# Altium schematic sheet Copy of PWR_PCB.SchDoc
size 863 x 558 mm
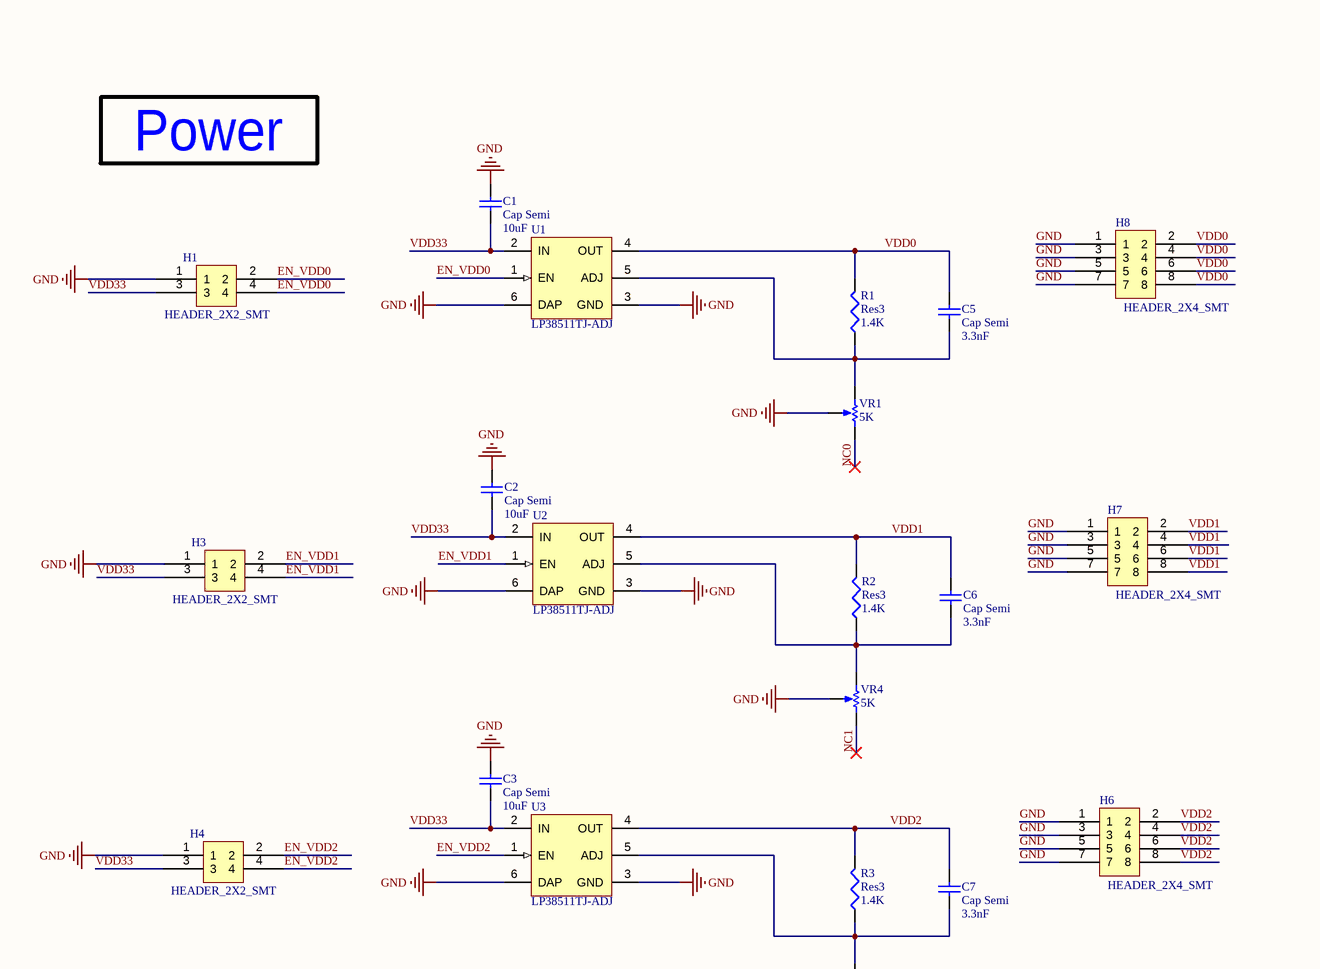
[diagram p0: Copy of PWR_PCB.SchDoc, top left]
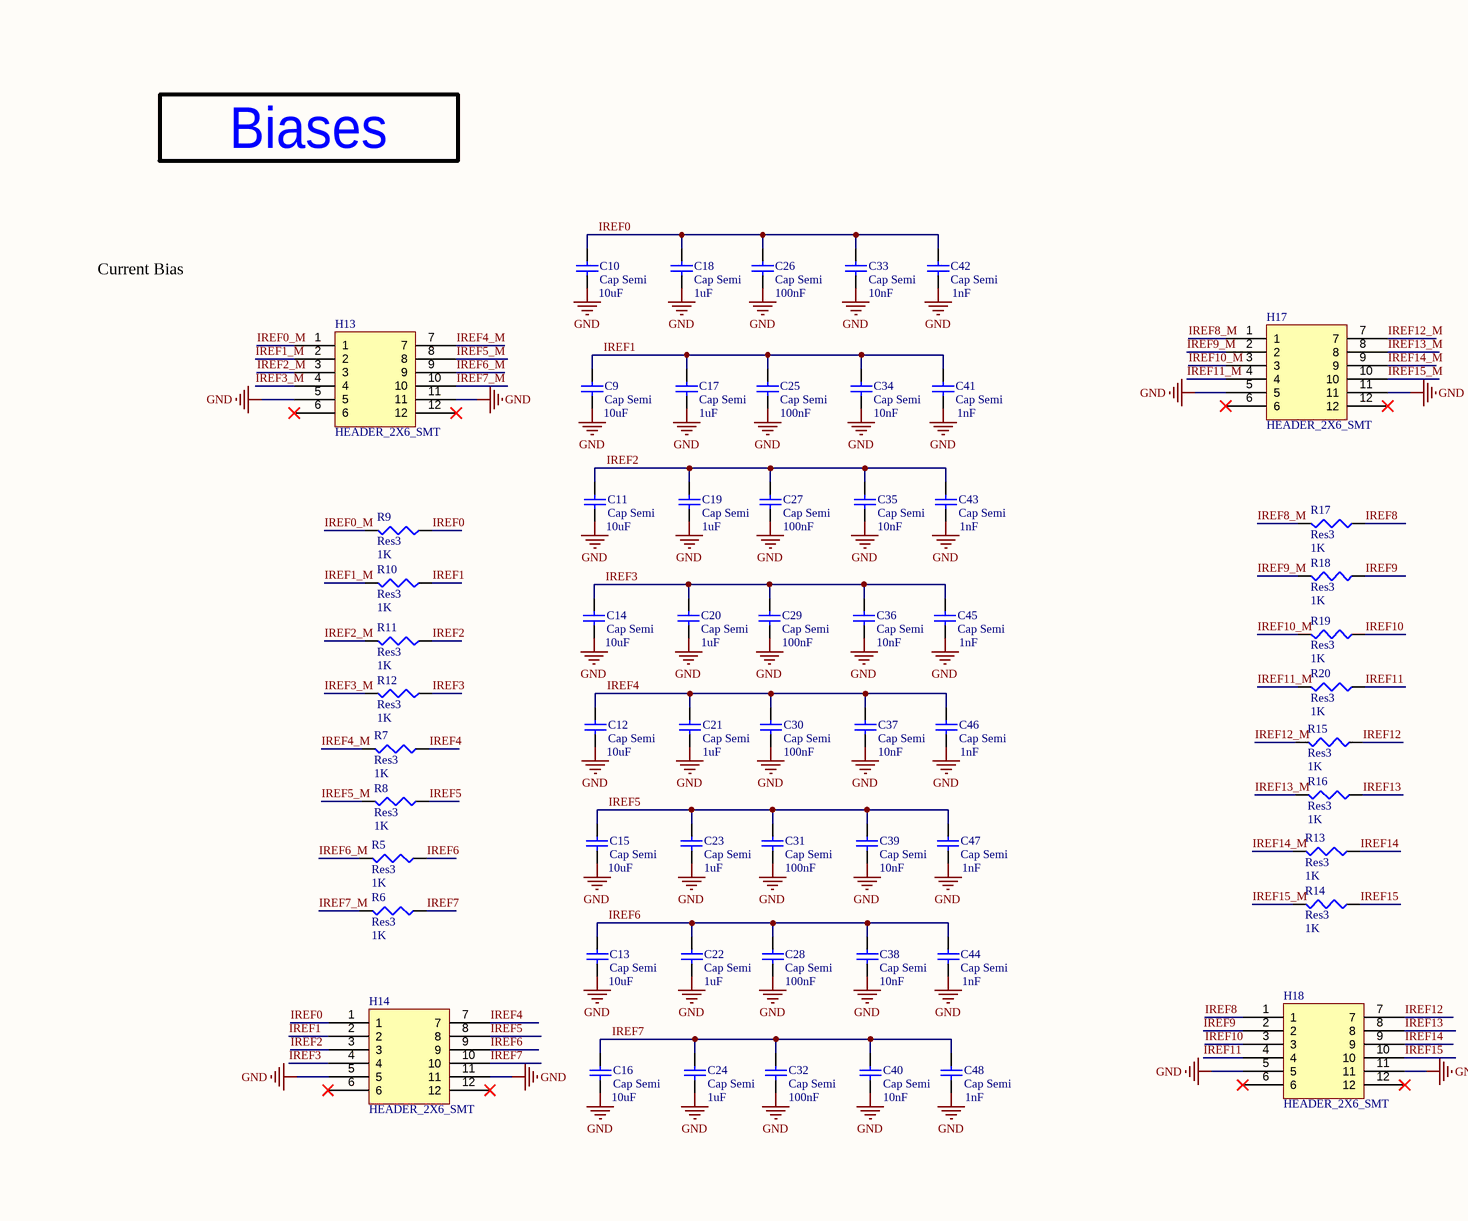
[diagram p1: Copy of PWR_PCB.SchDoc, top middle]
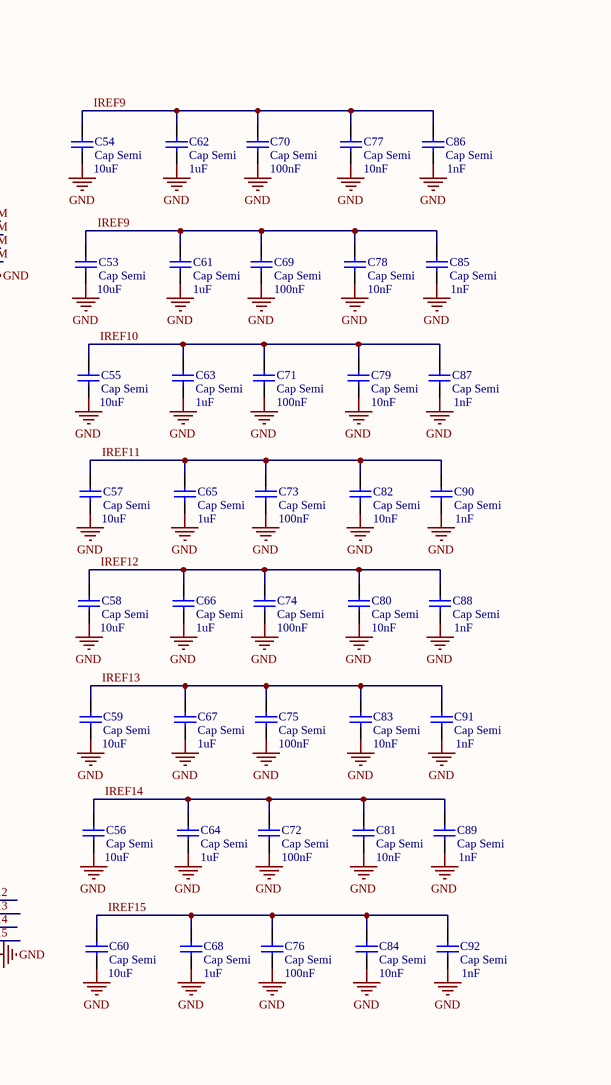
[diagram p2: Copy of PWR_PCB.SchDoc, top right]
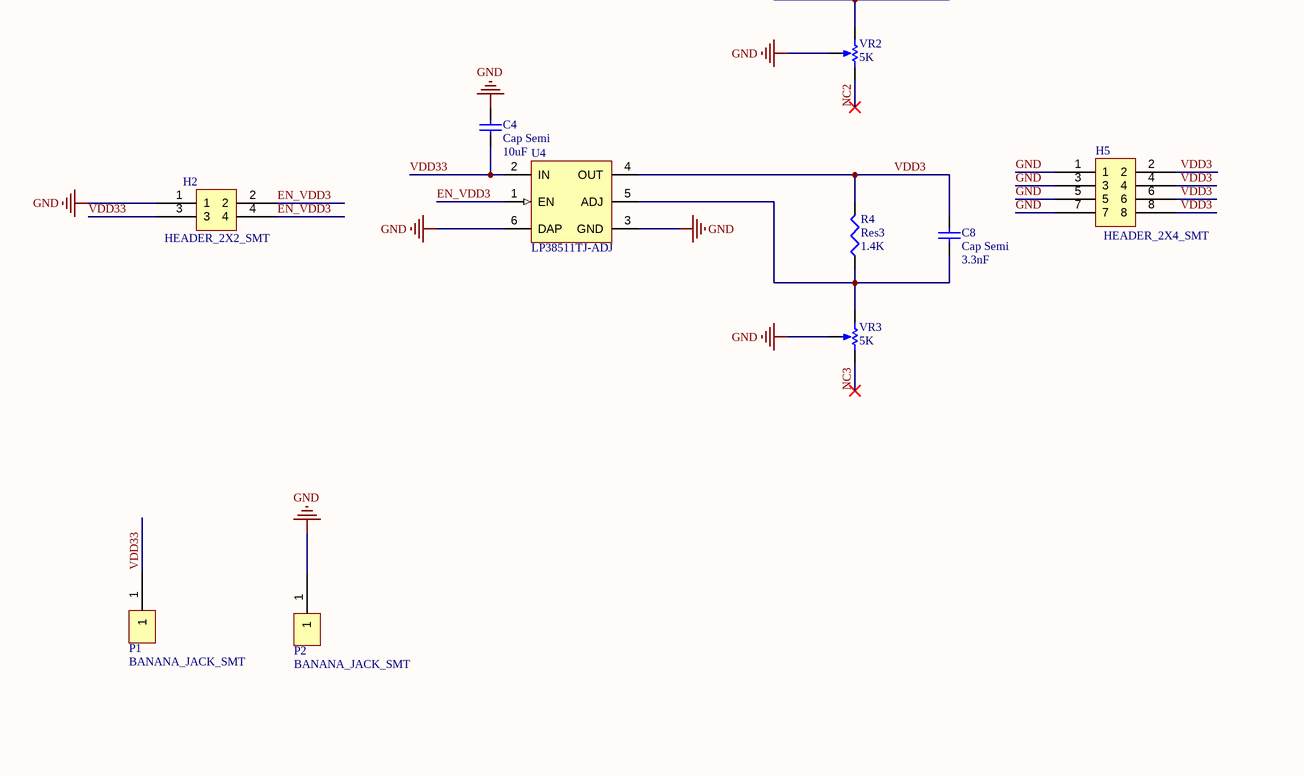
[diagram p3: Copy of PWR_PCB.SchDoc, bottom left]
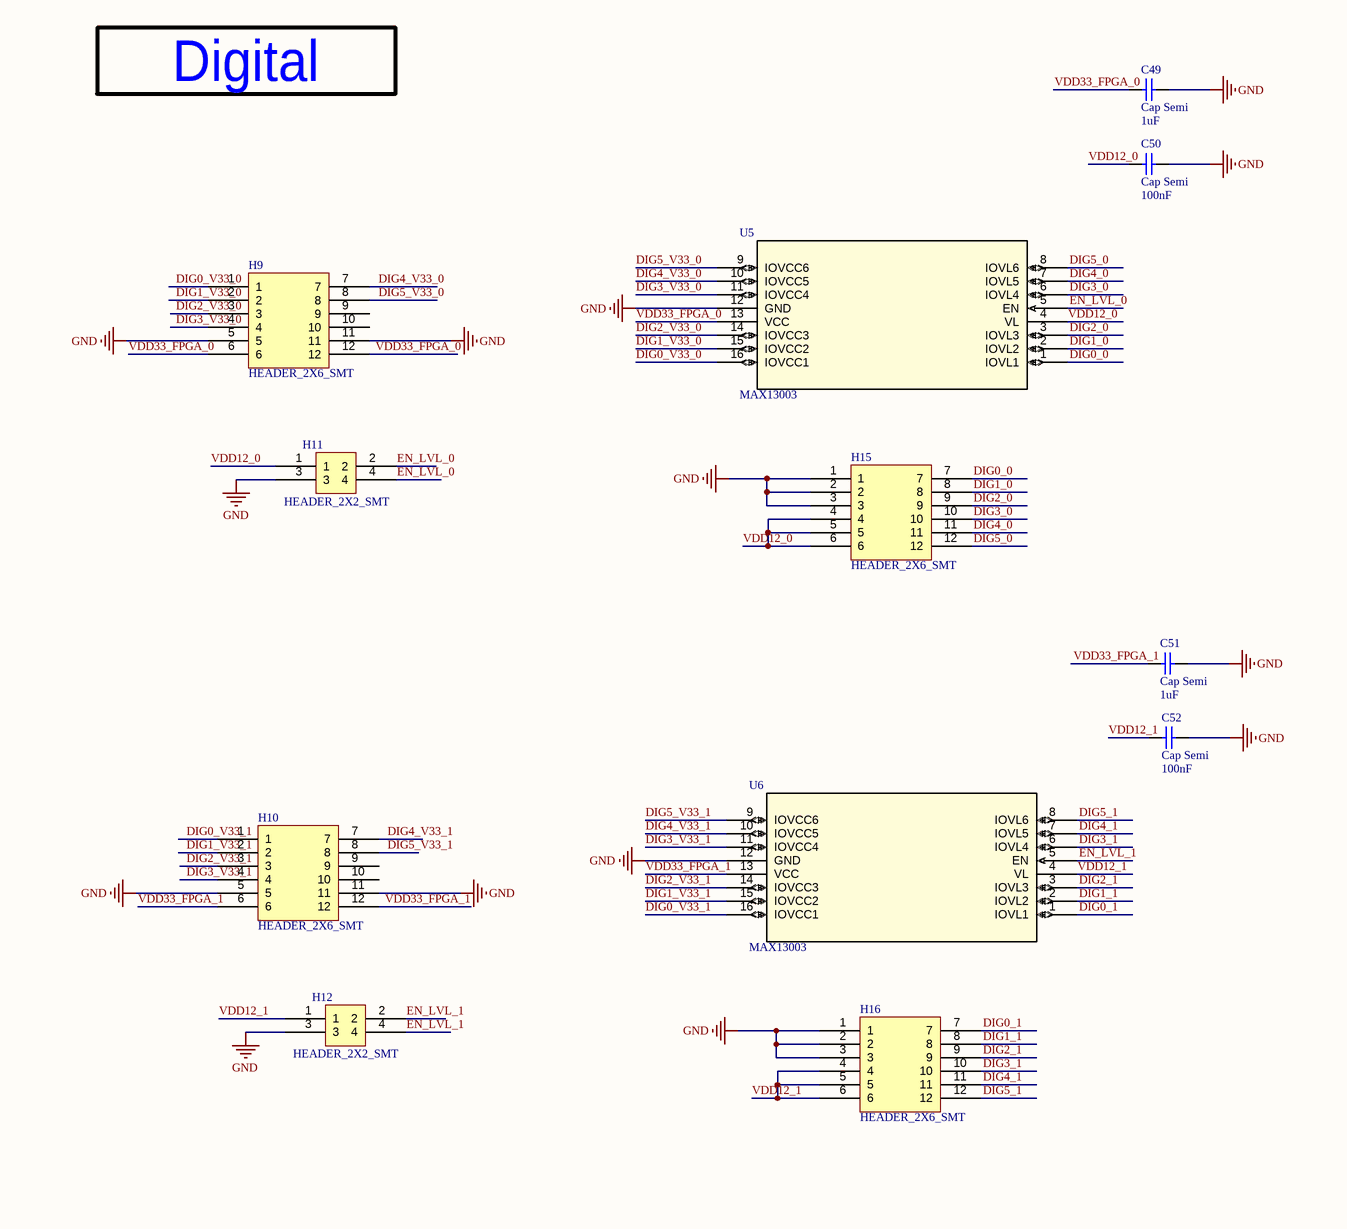
[diagram p4: Copy of PWR_PCB.SchDoc, bottom middle]
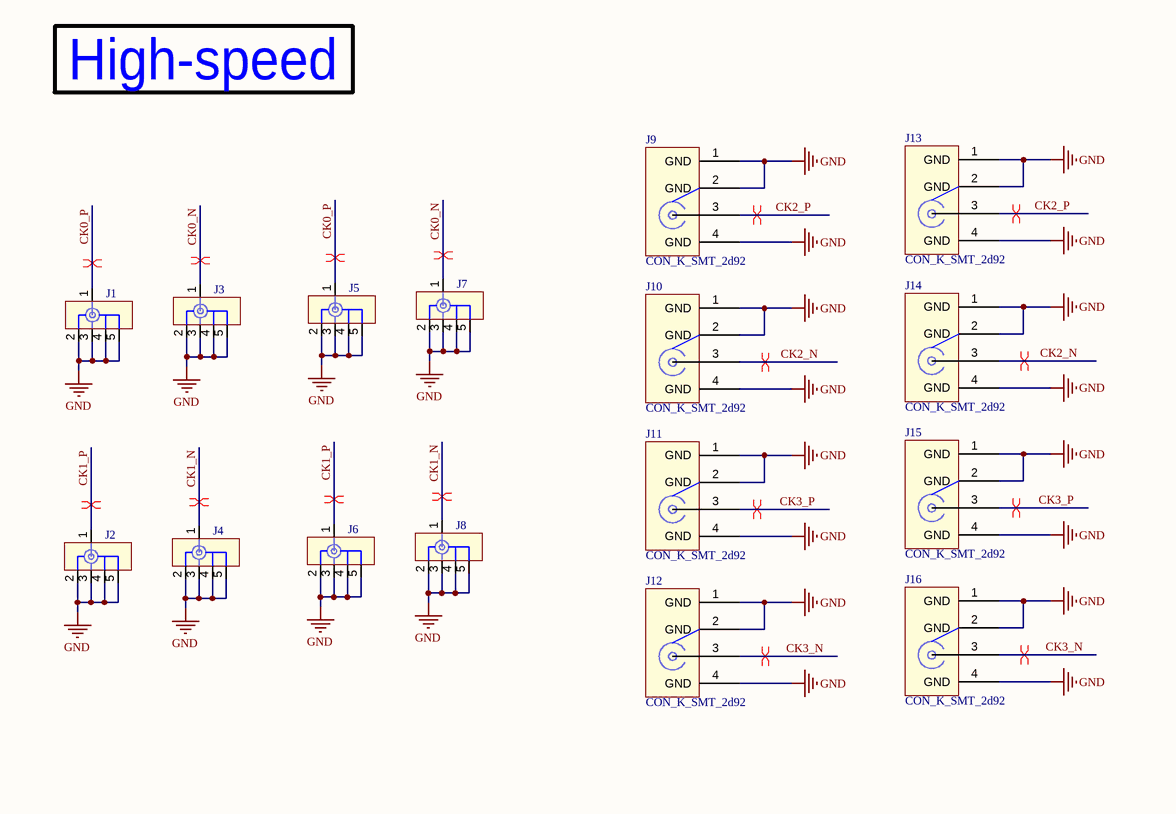
[diagram p5: Copy of PWR_PCB.SchDoc, bottom right]

## Parts
C1  Cap Semi  value 10uF  [1608[0603]]
C2  Cap Semi  value 10uF  [1608[0603]]
C3  Cap Semi  value 10uF  [1608[0603]]
C4  Cap Semi  value 10uF  [1608[0603]]
C5  Cap Semi  value 3.3nF  [1608[0603]]
C6  Cap Semi  value 3.3nF  [1608[0603]]
C7  Cap Semi  value 3.3nF  [1608[0603]]
C8  Cap Semi  value 3.3nF  [1608[0603]]
C9  Cap Semi  value 10uF  [1608[0603]]
C10  Cap Semi  value 10uF  [1608[0603]]
C11  Cap Semi  value 10uF  [1608[0603]]
C12  Cap Semi  value 10uF  [1608[0603]]
C13  Cap Semi  value 10uF  [1608[0603]]
C14  Cap Semi  value 10uF  [1608[0603]]
C15  Cap Semi  value 10uF  [1608[0603]]
C16  Cap Semi  value 10uF  [1608[0603]]
C17  Cap Semi  value 1uF  [1608[0603]]
C18  Cap Semi  value 1uF  [1608[0603]]
C19  Cap Semi  value 1uF  [1608[0603]]
C20  Cap Semi  value 1uF  [1608[0603]]
C21  Cap Semi  value 1uF  [1608[0603]]
C22  Cap Semi  value 1uF  [1608[0603]]
C23  Cap Semi  value 1uF  [1608[0603]]
C24  Cap Semi  value 1uF  [1608[0603]]
C25  Cap Semi  value 100nF  [1608[0603]]
C26  Cap Semi  value 100nF  [1608[0603]]
C27  Cap Semi  value 100nF  [1608[0603]]
C28  Cap Semi  value 100nF  [1608[0603]]
C29  Cap Semi  value 100nF  [1608[0603]]
C30  Cap Semi  value 100nF  [1608[0603]]
C31  Cap Semi  value 100nF  [1608[0603]]
C32  Cap Semi  value 100nF  [1608[0603]]
C33  Cap Semi  value 10nF  [1608[0603]]
C34  Cap Semi  value 10nF  [1608[0603]]
C35  Cap Semi  value 10nF  [1608[0603]]
C36  Cap Semi  value 10nF  [1608[0603]]
C37  Cap Semi  value 10nF  [1608[0603]]
C38  Cap Semi  value 10nF  [1608[0603]]
C39  Cap Semi  value 10nF  [1608[0603]]
C40  Cap Semi  value 10nF  [1608[0603]]
C41  Cap Semi  value 1nF  [1608[0603]]
C42  Cap Semi  value 1nF  [1608[0603]]
C43  Cap Semi  value 1nF  [1608[0603]]
C44  Cap Semi  value 1nF  [1608[0603]]
C45  Cap Semi  value 1nF  [1608[0603]]
C46  Cap Semi  value 1nF  [1608[0603]]
C47  Cap Semi  value 1nF  [1608[0603]]
C48  Cap Semi  value 1nF  [1608[0603]]
C49  Cap Semi  value 1uF  [1608[0603]]
C50  Cap Semi  value 100nF  [1608[0603]]
C51  Cap Semi  value 1uF  [1608[0603]]
C52  Cap Semi  value 100nF  [1608[0603]]
C53  Cap Semi  value 10uF  [1608[0603]]
C54  Cap Semi  value 10uF  [1608[0603]]
C55  Cap Semi  value 10uF  [1608[0603]]
C56  Cap Semi  value 10uF  [1608[0603]]
C57  Cap Semi  value 10uF  [1608[0603]]
C58  Cap Semi  value 10uF  [1608[0603]]
C59  Cap Semi  value 10uF  [1608[0603]]
C60  Cap Semi  value 10uF  [1608[0603]]
C61  Cap Semi  value 1uF  [1608[0603]]
C62  Cap Semi  value 1uF  [1608[0603]]
C63  Cap Semi  value 1uF  [1608[0603]]
C64  Cap Semi  value 1uF  [1608[0603]]
C65  Cap Semi  value 1uF  [1608[0603]]
C66  Cap Semi  value 1uF  [1608[0603]]
C67  Cap Semi  value 1uF  [1608[0603]]
C68  Cap Semi  value 1uF  [1608[0603]]
C69  Cap Semi  value 100nF  [1608[0603]]
C70  Cap Semi  value 100nF  [1608[0603]]
C71  Cap Semi  value 100nF  [1608[0603]]
C72  Cap Semi  value 100nF  [1608[0603]]
C73  Cap Semi  value 100nF  [1608[0603]]
C74  Cap Semi  value 100nF  [1608[0603]]
C75  Cap Semi  value 100nF  [1608[0603]]
C76  Cap Semi  value 100nF  [1608[0603]]
C77  Cap Semi  value 10nF  [1608[0603]]
C78  Cap Semi  value 10nF  [1608[0603]]
C79  Cap Semi  value 10nF  [1608[0603]]
C80  Cap Semi  value 10nF  [1608[0603]]
C81  Cap Semi  value 10nF  [1608[0603]]
C82  Cap Semi  value 10nF  [1608[0603]]
C83  Cap Semi  value 10nF  [1608[0603]]
C84  Cap Semi  value 10nF  [1608[0603]]
C85  Cap Semi  value 1nF  [1608[0603]]
C86  Cap Semi  value 1nF  [1608[0603]]
C87  Cap Semi  value 1nF  [1608[0603]]
C88  Cap Semi  value 1nF  [1608[0603]]
C89  Cap Semi  value 1nF  [1608[0603]]
C90  Cap Semi  value 1nF  [1608[0603]]
C91  Cap Semi  value 1nF  [1608[0603]]
C92  Cap Semi  value 1nF  [1608[0603]]
H1  HEADER_2X2_SMT  [HEADER_2X2_SMT]
H2  HEADER_2X2_SMT  [HEADER_2X2_SMT]
H3  HEADER_2X2_SMT  [HEADER_2X2_SMT]
H4  HEADER_2X2_SMT  [HEADER_2X2_SMT]
H5  HEADER_2X4_SMT  [HEADER_2X4_SMT]
H6  HEADER_2X4_SMT  [HEADER_2X4_SMT]
H7  HEADER_2X4_SMT  [HEADER_2X4_SMT]
H8  HEADER_2X4_SMT  [HEADER_2X4_SMT]
H9  HEADER_2X6_SMT  [HDR2X6_SMT]
H10  HEADER_2X6_SMT  [HDR2X6_SMT]
H11  HEADER_2X2_SMT  [HEADER_2X2_SMT]
H12  HEADER_2X2_SMT  [HEADER_2X2_SMT]
H13  HEADER_2X6_SMT  [HDR2X6_SMT]
H14  HEADER_2X6_SMT  [HDR2X6_SMT]
H15  HEADER_2X6_SMT  [HDR2X6_SMT]
H16  HEADER_2X6_SMT  [HDR2X6_SMT]
H17  HEADER_2X6_SMT  [HDR2X6_SMT]
H18  HEADER_2X6_SMT  [HDR2X6_SMT]
J1  Con RF SMA  [CON-001-250X250/SMA-SMT]  (value not drawn)
J2  Con RF SMA  [CON-001-250X250/SMA-SMT]  (value not drawn)
J3  Con RF SMA  [CON-001-250X250/SMA-SMT]  (value not drawn)
J4  Con RF SMA  [CON-001-250X250/SMA-SMT]  (value not drawn)
J5  Con RF SMA  [CON-001-250X250/SMA-SMT]  (value not drawn)
J6  Con RF SMA  [CON-001-250X250/SMA-SMT]  (value not drawn)
J7  Con RF SMA  [CON-001-250X250/SMA-SMT]  (value not drawn)
J8  Con RF SMA  [CON-001-250X250/SMA-SMT]  (value not drawn)
J9  CON_K_SMT_2d92  [CON_K_SMT_2d92]
J10  CON_K_SMT_2d92  [CON_K_SMT_2d92]
J11  CON_K_SMT_2d92  [CON_K_SMT_2d92]
J12  CON_K_SMT_2d92  [CON_K_SMT_2d92]
J13  CON_K_SMT_2d92  [CON_K_SMT_2d92]
J14  CON_K_SMT_2d92  [CON_K_SMT_2d92]
J15  CON_K_SMT_2d92  [CON_K_SMT_2d92]
J16  CON_K_SMT_2d92  [CON_K_SMT_2d92]
P1  BANANA_JACK_SMT  [BANANA_JACK_SMT]
P2  BANANA_JACK_SMT  [BANANA_JACK_SMT]
R1  Res3  value 1.4K  [J1-0603]
R2  Res3  value 1.4K  [J1-0603]
R3  Res3  value 1.4K  [J1-0603]
R4  Res3  value 1.4K  [J1-0603]
R5  Res3  value 1K  [J1-0603]
R6  Res3  value 1K  [J1-0603]
R7  Res3  value 1K  [J1-0603]
R8  Res3  value 1K  [J1-0603]
R9  Res3  value 1K  [J1-0603]
R10  Res3  value 1K  [J1-0603]
R11  Res3  value 1K  [J1-0603]
R12  Res3  value 1K  [J1-0603]
R13  Res3  value 1K  [J1-0603]
R14  Res3  value 1K  [J1-0603]
R15  Res3  value 1K  [J1-0603]
R16  Res3  value 1K  [J1-0603]
R17  Res3  value 1K  [J1-0603]
R18  Res3  value 1K  [J1-0603]
R19  Res3  value 1K  [J1-0603]
R20  Res3  value 1K  [J1-0603]
U1  LP38511TJ-ADJ  [TJ5A_N]
U2  LP38511TJ-ADJ  [TJ5A_N]
U3  LP38511TJ-ADJ  [TJ5A_N]
U4  LP38511TJ-ADJ  [TJ5A_N]
U5  MAX13003  [MAX13003]
U6  MAX13003  [MAX13003]
VR1  5K  [POT_3214_Top]
VR2  5K  [POT_3214_Top]
VR3  5K  [POT_3214_Top]
VR4  5K  [POT_3214_Top]

## Nets
GND: C1.1 C2.1 C3.1 C4.1 C9.1 C10.1 C11.1 C12.1 C13.1 C14.1 C15.1 C16.1 C17.1 C18.1 C19.1 C20.1 C21.1 C22.1 C23.1 C24.1 C25.1 C26.1 C27.1 C28.1 C29.1 C30.1 C31.1 C32.1 C33.1 C34.1 C35.1 C36.1 C37.1 C38.1 C39.1 C40.1 C41.1 C42.1 C43.1 C44.1 C45.1 C46.1 C47.1 C48.1 C49.1 C50.1 C51.1 C52.1 C53.1 C54.1 C55.1 C56.1 C57.1 C58.1 C59.1 C60.1 C61.1 C62.1 C63.1 C64.1 C65.1 C66.1 C67.1 C68.1 C69.1 C70.1 C71.1 C72.1 C73.1 C74.1 C75.1 C76.1 C77.1 C78.1 C79.1 C80.1 C81.1 C82.1 C83.1 C84.1 C85.1 C86.1 C87.1 C88.1 C89.1 C90.1 C91.1 C92.1 H1.1 H2.1 H3.1 H4.1 H5.1 H5.3 H5.5 H5.7 H6.1 H6.3 H6.5 H6.7 H7.1 H7.3 H7.5 H7.7 H8.1 H8.3 H8.5 H8.7 H9.5 H9.11 H10.5 H10.11 H11.3 H12.3 H13.5 H13.11 H14.5 H14.11 H15.1 H15.2 H15.3 H16.1 H16.2 H16.3 H17.5 H17.11 H18.5 H18.11 J1.2 J1.3 J1.4 J1.5 J2.2 J2.3 J2.4 J2.5 J3.2 J3.3 J3.4 J3.5 J4.2 J4.3 J4.4 J4.5 J5.2 J5.3 J5.4 J5.5 J6.2 J6.3 J6.4 J6.5 J7.2 J7.3 J7.4 J7.5 J8.2 J8.3 J8.4 J8.5 J9.1(GND) J9.2(GND) J9.4(GND) J10.1(GND) J10.2(GND) J10.4(GND) J11.1(GND) J11.2(GND) J11.4(GND) J12.1(GND) J12.2(GND) J12.4(GND) J13.1(GND) J13.2(GND) J13.4(GND) J14.1(GND) J14.2(GND) J14.4(GND) J15.1(GND) J15.2(GND) J15.4(GND) J16.1(GND) J16.2(GND) J16.4(GND) P2.1 U1.3(GND) U1.6(DAP) U2.3(GND) U2.6(DAP) U3.3(GND) U3.6(DAP) U4.3(GND) U4.6(DAP) U5.12(GND) U6.12(GND) VR1.2(TAP) VR2.2(TAP) VR3.2(TAP) VR4.2(TAP)
CK0_N: J3.1 J7.1
CK0_P: J1.1 J5.1
CK1_N: J4.1 J8.1
CK1_P: J2.1 J6.1
CK2_N: J10.3 J14.3
CK2_P: J9.3 J13.3
CK3_N: J12.3 J16.3
CK3_P: J11.3 J15.3
DIG0_0: H15.7 U5.1(IOVL1)
DIG0_1: H16.7 U6.1(IOVL1)
DIG0_V33_0: H9.1 U5.16(IOVCC1)
DIG0_V33_1: H10.1 U6.16(IOVCC1)
DIG1_0: H15.8 U5.2(IOVL2)
DIG1_1: H16.8 U6.2(IOVL2)
DIG1_V33_0: H9.2 U5.15(IOVCC2)
DIG1_V33_1: H10.2 U6.15(IOVCC2)
DIG2_0: H15.9 U5.3(IOVL3)
DIG2_1: H16.9 U6.3(IOVL3)
DIG2_V33_0: H9.3 U5.14(IOVCC3)
DIG2_V33_1: H10.3 U6.14(IOVCC3)
DIG3_0: H15.10 U5.6(IOVL4)
DIG3_1: H16.10 U6.6(IOVL4)
DIG3_V33_0: H9.4 U5.11(IOVCC4)
DIG3_V33_1: H10.4 U6.11(IOVCC4)
DIG4_0: H15.11 U5.7(IOVL5)
DIG4_1: H16.11 U6.7(IOVL5)
DIG4_V33_0: H9.7 U5.10(IOVCC5)
DIG4_V33_1: H10.7 U6.10(IOVCC5)
DIG5_0: H15.12 U5.8(IOVL6)
DIG5_1: H16.12 U6.8(IOVL6)
DIG5_V33_0: H9.8 U5.9(IOVCC6)
DIG5_V33_1: H10.8 U6.9(IOVCC6)
EN_LVL_0: H11.2 H11.4 U5.5(EN)
EN_LVL_1: H12.2 H12.4 U6.5(EN)
EN_VDD0: H1.2 H1.4 U1.1(EN)
EN_VDD1: H3.2 H3.4 U2.1(EN)
EN_VDD2: H4.2 H4.4 U3.1(EN)
EN_VDD3: H2.2 H2.4 U4.1(EN)
IREF0: C10.2 C18.2 C26.2 C33.2 C42.2 H14.1 R9.1
IREF0_M: H13.1 R9.2
IREF1: C9.2 C17.2 C25.2 C34.2 C41.2 H14.2 R10.1
IREF1_M: H13.2 R10.2
IREF2: C11.2 C19.2 C27.2 C35.2 C43.2 H14.3 R11.1
IREF2_M: H13.3 R11.2
IREF3: C14.2 C20.2 C29.2 C36.2 C45.2 H14.4 R12.1
IREF3_M: H13.4 R12.2
IREF4: C12.2 C21.2 C30.2 C37.2 C46.2 H14.7 R7.1
IREF4_M: H13.7 R7.2
IREF5: C15.2 C23.2 C31.2 C39.2 C47.2 H14.8 R8.1
IREF5_M: H13.8 R8.2
IREF6: C13.2 C22.2 C28.2 C38.2 C44.2 H14.9 R5.1
IREF6_M: H13.9 R5.2
IREF7: C16.2 C24.2 C32.2 C40.2 C48.2 H14.10 R6.1
IREF7_M: H13.10 R6.2
IREF8: H18.1 R17.1
IREF8_M: H17.1 R17.2
IREF9: C53.2 C54.2 C61.2 C62.2 C69.2 C70.2 C77.2 C78.2 C85.2 C86.2 H18.2 R18.1
IREF9_M: H17.2 R18.2
IREF10: C55.2 C63.2 C71.2 C79.2 C87.2 H18.3 R19.1
IREF10_M: H17.3 R19.2
IREF11: C57.2 C65.2 C73.2 C82.2 C90.2 H18.4 R20.1
IREF11_M: H17.4 R20.2
IREF12: C58.2 C66.2 C74.2 C80.2 C88.2 H18.7 R15.1
IREF12_M: H17.7 R15.2
IREF13: C59.2 C67.2 C75.2 C83.2 C91.2 H18.8 R16.1
IREF13_M: H17.8 R16.2
IREF14: C56.2 C64.2 C72.2 C81.2 C89.2 H18.9 R13.1
IREF14_M: H17.9 R13.2
IREF15: C60.2 C68.2 C76.2 C84.2 C92.2 H18.10 R14.1
IREF15_M: H17.10 R14.2
NC0: VR1.3(BOT)
NC1: VR4.3(BOT)
NC2: VR2.3(BOT)
NC3: VR3.3(BOT)
VDD0: C5.2 H8.2 H8.4 H8.6 H8.8 R1.2 U1.4(OUT)
VDD1: C6.2 H7.2 H7.4 H7.6 H7.8 R2.2 U2.4(OUT)
VDD2: C7.2 H6.2 H6.4 H6.6 H6.8 R3.2 U3.4(OUT)
VDD3: C8.2 H5.2 H5.4 H5.6 H5.8 R4.2 U4.4(OUT)
VDD12_0: C50.2 H11.1 H15.4 H15.5 H15.6 U5.4(VL)
VDD12_1: C52.2 H12.1 H16.4 H16.5 H16.6 U6.4(VL)
VDD33: C1.2 C2.2 C3.2 C4.2 H1.3 H2.3 H3.3 H4.3 P1.1 U1.2(IN) U2.2(IN) U3.2(IN) U4.2(IN)
VDD33_FPGA_0: C49.2 H9.6 H9.12 U5.13(VCC)
VDD33_FPGA_1: C51.2 H10.6 H10.12 U6.13(VCC)
NetC5_1: C5.1 R1.1 U1.5(ADJ) VR1.1(TOP)
NetC6_1: C6.1 R2.1 U2.5(ADJ) VR4.1(TOP)
NetC7_1: C7.1 R3.1 U3.5(ADJ) VR2.1(TOP)
NetC8_1: C8.1 R4.1 U4.5(ADJ) VR3.1(TOP)

Not connected (* = marked no-connect by the designer): H9 9 10; H10 9 10; H13 6* 12*; H14 6* 12*; H17 6* 12*; H18 6* 12*

## Layout directives
differential pair: CK0_N, CK0_P, CK1_N, CK1_P, CK2_N, CK2_P, CK3_N, CK3_P

## Notes on the sheet
- Biases
- Current Bias
- Power
- Digital
- High-speed signals
- DWG. NO.
- REV.
- SHT.
- REVISION
- DESCRIPTION
- DATE
- APPROVED
- THIS DOCUMENT AND THE DATA DISCLOSED HEREIN OR HEREWITH IS THE PROPERTY OF ALTIUM LIMITED AND MAY BE FREELY DISTRIBUTED IN WHOLE. NO RIGHTS ARE RESERVED OR EXPRESS OR IMPLIED WARANTEE GIVEN.
- ENG:
- DSN:
- APPROVALS
- PROJECT
- DOCUMENT REVISION:
- DESIGN ITEM:
- CHK:
- BOM:
- REFERENCE DOCUMENTS
- PROJECT REVISION:
- TITLE
- FAB DWG:
- PCB DWG:
- ASSY DWG:
- SCALE:
- SIZE
- D
- CAGE CODE
- FILE NAME
- DWG NO.
- SHEET
- OF
- REV

## Library data of the parts
C1-C92 = Cap Semi: Capacitor (Semiconductor SIM Model); Published: 8-Jun-2000; LatestRevisionDate: 29-May-2009; LatestRevisionNote: IPC-7351 Footprint Added.; PackageReference: C1206; Publisher: Altium Limited; PackageDescription: Chip Capacitor
J1-J8 = CON_RF_SMA
J9-J16 = CON_K_SMT_2d92: Con RF K
R1-R20 = Res3: Resistor; Published: 8-Jun-2000; LatestRevisionDate: 29-May-2009; LatestRevisionNote: IPC-7351 Footprint Added.; PackageReference: J1-0603; Publisher: Altium Limited; PackageDescription: Chip Resistor
U1-U4 = LP38511TJ-ADJ: 800 mA Fast-Transient Response Low-Dropout Linear Voltage Regulator with Error Flag, 6-pin TO-263 Thin; Manufacturer: National Semiconductor; PackageTopMarking: NSUZXYTTE#*LP38511*TJ-ADJ; PowerWise: N; CompType: LDO IC; High-Reliability: Y; DatasheetVersion: Feb-2009; PackageVersion: revE, Jan-2008; PackageReference: TJ5A; PackageDescription: Thin TO-263, Molded, 9.85 x 10.16 x 2mm Body, 5 Lead, 1.7mm Pitch, Surface Mount; PartNumber: LP38511TJ-ADJ; RoHS: Y; PinCount: 5; ComponentLink1Description: Manufacturer URL; ComponentLink1URL: http://www.national.com/; ComponentLink2Description: LP38511 Datasheet; ComponentLink2URL: http://www.national.com/ds/LP/LP38511-ADJ.pdf; ComponentLink3Description: LP38511 Web Page; ComponentLink3URL: http://www.national.com/pf/LP/LP38511.html; ComponentLink4Description: TJ5A Package Page; ComponentLink4URL: http://www.national.com/packaging/folders/tj5a.html
VR1-VR4 = RPot_5K: Potentiometer; Manufacturer: Bourns; Manufacturer ID: 3214X-1-502E; Digikey ID: 3214X-1-502ECT-ND